# Altium schematic sheet AFE_ADC.SchDoc: Shuttler AFE
size A4; Author: G.Kasprowicz; CompanyName: WUT ISE; DrawnBy: G.Kasprowicz; Organization: WUT ISE; Address1: PW ISE; Address2: Nowowiejska 15/19 00-665 Warsaw; Address3: gkasprow@gmail.com; DocumentNumber: 2; SheetNumber: 2; SheetTotal: 6; ModifiedBy: -; CheckedDate: -; Title2: ADC; DivGrp: WUT ISE; Designer: G.Kasprowicz; ModifiedDate: -; ProjectName: Sensor Box
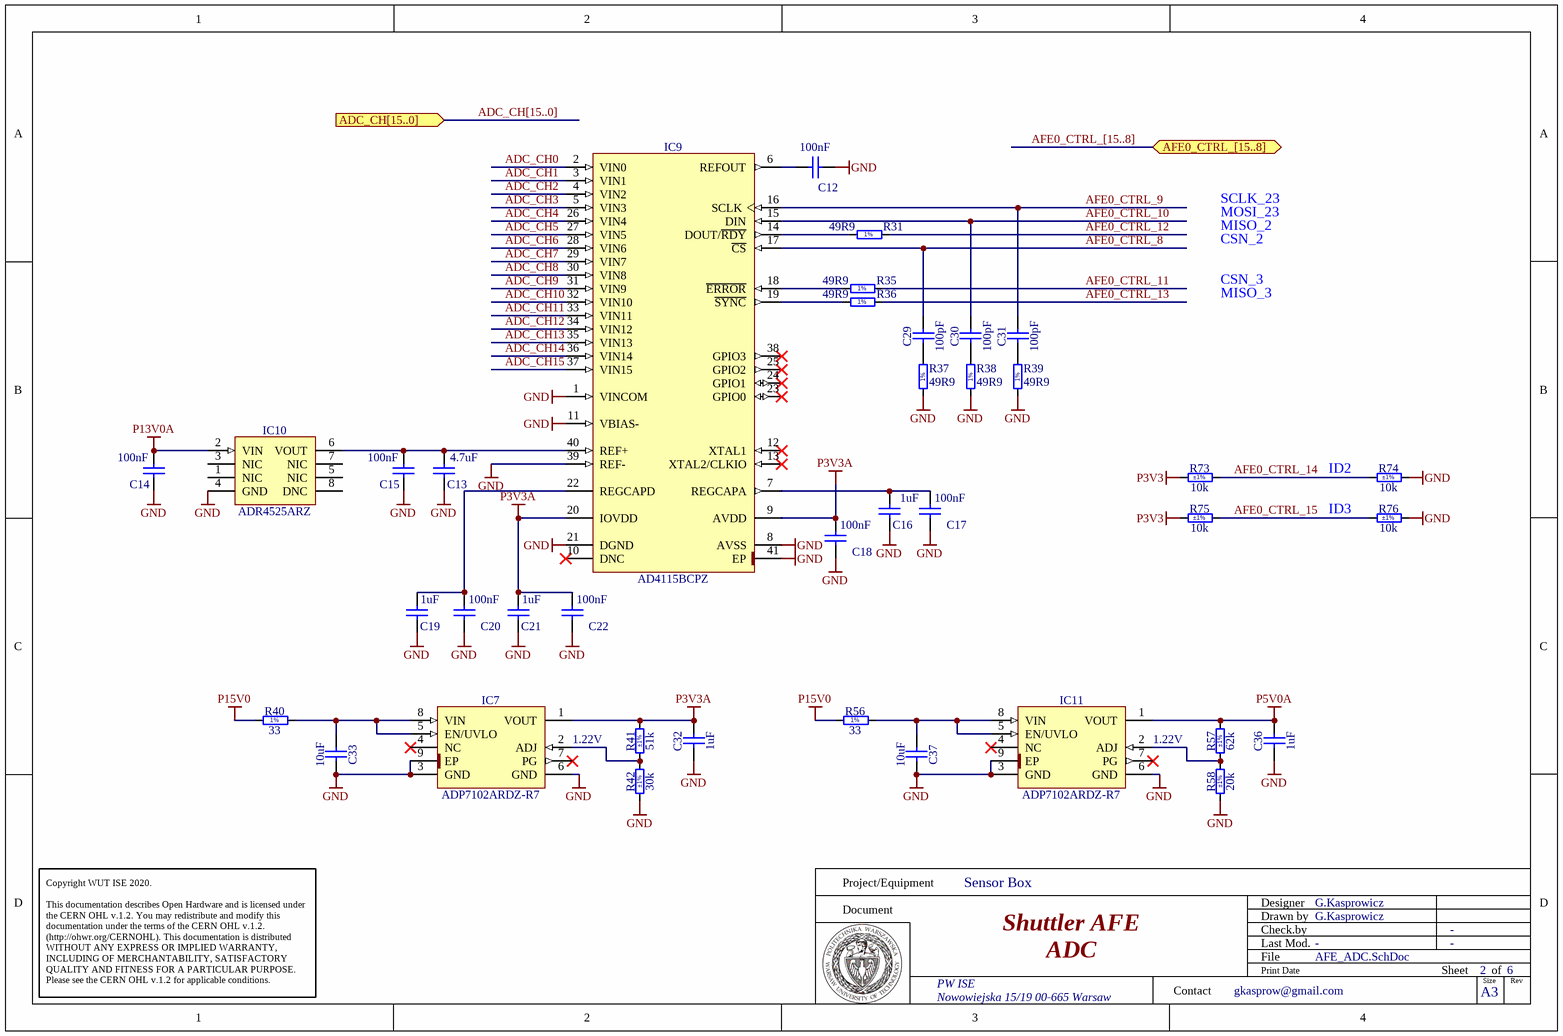
[diagram p0: AFE_ADC.SchDoc]

## Parts
C12  100nF  [CAPC1005X55N]
C13  4.7uF  [CAPC1608X90N]
C14  100nF  [CAPC1005X55N]
C15  100nF  [CAPC1005X55N]
C16  1uF  [CAPC1608X87N]
C17  100nF  [CAPC1005X55N]
C18  100nF  [CAPC1005X55N]
C19  1uF  [CAPC1608X87N]
C20  100nF  [CAPC1005X55N]
C21  1uF  [CAPC1608X87N]
C22  100nF  [CAPC1005X55N]
C29  100pF  [CAPC1005X55N]
C30  100pF  [CAPC1005X55N]
C31  100pF  [CAPC1005X55N]
C32  1uF  [CAPC1608X87N]
C33  10uF  [CAPC2012X135N]
C36  1uF  [CAPC1608X87N]
C37  10uF  [CAPC2012X135N]
IC7  ADP7102ARDZ-R7  [SOIC127P600X175-9N-R241X309]
IC9  AD4115BCPZ  [QFN50P600X600X100-41N-S470]
IC10  ADR4525ARZ  [SOIC127P600X175-8N]
IC11  ADP7102ARDZ-R7  [SOIC127P600X175-9N-R241X309]
R31  49R9  [RESC1005X40N]
R35  49R9  [RESC1005X40N]
R36  49R9  [RESC1005X40N]
R37  49R9  [RESC1005X40N]
R38  49R9  [RESC1005X40N]
R39  49R9  [RESC1005X40N]
R40  33  [RESC1005X40N]
R41  51k  Tolerance: ±1%  [RESC1005X40N]
R42  30k  Tolerance: ±1%  [RESC1005X40N]
R56  33  [RESC1005X40N]
R57  62k  Tolerance: ±1%  [RESC1005X40N]
R58  20k  Tolerance: ±1%  [RESC1005X40N]
R73  10k  Tolerance: ±1%  [RESC1005X40N]
R74  10k  Tolerance: ±1%  [RESC1005X40N]
R75  10k  Tolerance: ±1%  [RESC1005X40N]
R76  10k  Tolerance: ±1%  [RESC1005X40N]

## Ports
ADC_CH[15..0] (in), AFE0_CTRL_[15..8] (bidir)

## Nets
GND: C12.2 C13.1 C14.2 C15.2 C16.1 C17.2 C18.2 C19.1 C20.2 C21.1 C22.2 C32.1 C33.2 C36.1 C37.2 IC7.3(GND) IC7.6(GND) IC7.9(EP) IC9.1(VINCOM) IC9.8(AVSS) IC9.11(VBIAS-) IC9.21(DGND) IC9.39(REF-) IC9.41(EP) IC10.4(GND) IC11.3(GND) IC11.6(GND) IC11.9(EP) R37.1 R38.1 R39.1 R42.1 R58.1 R74.2 R76.2
P3V3: R73.1 R75.1
P3V3A: C18.1 C21.2 C22.1 C32.2 IC7.1(VOUT) IC9.9(AVDD) IC9.20(IOVDD) R41.2
P5V0A: C36.2 IC11.1(VOUT) R57.2
P13V0A: C14.1 IC10.2(VIN)
P15V0: R40.1 R56.1
ADC_CH0: IC9.2(VIN0)
ADC_CH1: IC9.3(VIN1)
ADC_CH2: IC9.4(VIN2)
ADC_CH3: IC9.5(VIN3)
ADC_CH4: IC9.26(VIN4)
ADC_CH5: IC9.27(VIN5)
ADC_CH6: IC9.28(VIN6)
ADC_CH7: IC9.29(VIN7)
ADC_CH8: IC9.30(VIN8)
ADC_CH9: IC9.31(VIN9)
ADC_CH10: IC9.32(VIN10)
ADC_CH11: IC9.33(VIN11)
ADC_CH12: IC9.34(VIN12)
ADC_CH13: IC9.35(VIN13)
ADC_CH14: IC9.36(VIN14)
ADC_CH15: IC9.37(VIN15)
AFE0_CTRL_8: C29.2 IC9.17(~{CS})
AFE0_CTRL_9: C31.2 IC9.16(SCLK)
AFE0_CTRL_10: C30.2 IC9.15(DIN)
AFE0_CTRL_11: R35.2
AFE0_CTRL_12: R31.2
AFE0_CTRL_13: R36.2
AFE0_CTRL_14: R73.2 R74.1
AFE0_CTRL_15: R75.2 R76.1
NetC12_1: C12.1 IC9.6(REFOUT)
NetC13_2: C13.2 C15.1 IC9.40(REF+) IC10.6(VOUT)
NetC16_2: C16.2 C17.1 IC9.7(REGCAPA)
NetC19_2: C19.2 C20.1 IC9.22(REGCAPD)
NetC29_1: C29.1 R37.2
NetC30_1: C30.1 R38.2
NetC31_1: C31.1 R39.2
NetC33_1: C33.1 IC7.5(EN/UVLO) IC7.8(VIN) R40.2
NetC37_1: C37.1 IC11.5(EN/UVLO) IC11.8(VIN) R56.2
NetIC7_2: IC7.2(ADJ) R41.1 R42.2
NetIC9_14: IC9.14(DOUT/~{RDY}) R31.1
NetIC9_18: IC9.18(~{ERROR}) R35.1
NetIC9_19: IC9.19(~{SYNC}) R36.1
NetIC11_2: IC11.2(ADJ) R57.1 R58.2

Not connected (* = marked no-connect by the designer): IC7 4(NC)* 7(PG)*; IC9 10(DNC)* 12(XTAL1)* 13(XTAL2/CLKIO)* 23(GPIO0)* 24(GPIO1)* 25(GPIO2)* 38(GPIO3)*; IC10 1(NIC) 3(NIC) 5(NIC) 7(NIC) 8(DNC); IC11 4(NC)* 7(PG)*

## Buses and harness runs
bus ADC_CH[15..0] = port ADC_CH[15..0]
bus AFE0_CTRL_[15..8] = port AFE0_CTRL_[15..8]

## Notes on the sheet
- MOSI_23
- MISO_2
- CSN_2
- SCLK_23
- CSN_3
- MISO_3
- (near R74) ID2
- ID3
- 1.22V
- Project/Equipment
- Document
- Designer
- Drawn by
- Check.by
- Copyright WUT ISE 2020.
  This documentation describes Open Hardware and is licensed under the CERN OHL v.1.2. You may redistribute and modify this documentation under the terms of the CERN OHL v.1.2. (http://ohwr.org/CERNOHL). This documentation is distributed WITHOUT ANY EXPRESS OR IMPLIED WARRANTY, INCLUDING OF MERCHANTABILITY, SATISFACTORY QUALITY AND FITNESS FOR A PARTICULAR PURPOSE. Please see the CERN OHL v.1.2 for applicable conditions.
- Contact
- File
- Last Mod.
- Print Date
- Sheet
- Size
- A3
- of
- Rev
- (in symbol R0402_33R_1%_0.0625W_100PPM) 1%
- (in symbol R0402_49R9_1%_0.0625W_100PPM) 1%

## Library data of the parts
C12 C14 C15 C17 C18 C20 C22 = CC0402_100NF_16V_10%_X5R: Non-polarised capacitor; Part Description: SMD Multilayer Chip Ceramic Capacitor; Manufacturer: GENERIC; Manufacturer1 Part Number: GRM155R61C104KA88D; Voltage: 16V; TC: X5R; Tolerance: ±10%; Part Number: CC0402_100NF_16V_10%_X5R; Component Kind: Standard; Component Type: Standard; Pin Count: 2; Value: 100nF; Status: None; Manufacturer Part Number: CC0402_100NF_16V_10%_X5R; Case: 0402; Mounted: Yes; Socket: No; SMD: Yes; Sense: No; Manufacturer1 Example: MURATA; Manufacturer1 ComponentHeight: 0.55mm; HelpURL: \\cern.ch\dfs\Applications\Altium\Datasheets\CC0402_X5R_MURATA_GRM.pdf; Author: CERN DEM JLC; CreateDate: 10.12.2013; LatestRevisionDate: 10.12.2013
C13 = CC0603_4.7UF_25V_10%_X5R: Non-polarised capacitor; Part Description: SMD Multilayer Chip Ceramic Capacitor; Manufacturer: GENERIC; Manufacturer1 Part Number: GRM188R61E475KE11D; Voltage: 25V; TC: X5R; Tolerance: ±10%; Part Number: CC0603_4.7UF_25V_10%_X5R; Component Kind: Standard; Component Type: Standard; Pin Count: 2; Value: 4.7uF; Status: None; Manufacturer Part Number: CC0603_4.7UF_25V_10%_X5R; Case: 0603; Mounted: Yes; Socket: No; SMD: Yes; Sense: No; Manufacturer1 Example: MURATA; Manufacturer1 ComponentHeight: 0.95mm; HelpURL: \\cern.ch\dfs\Applications\Altium\Datasheets\CC0603_MURATA_GRM188R61E475KE11D.pdf; Author: CERN DEM JLC; CreateDate: 10.11.2014; LatestRevisionDate: 10.11.2014
C16 C19 C21 = CC0603_1UF_16V_10%_X7R: Non-polarised capacitor; Part Description: SMD Multilayer Chip Ceramic Capacitor; Manufacturer: GENERIC; Manufacturer1 Part Number: 223878615663; Voltage: 16V; TC: X7R; Tolerance: ±10%; Part Number: CC0603_1UF_16V_10%_X7R; Component Kind: Standard; Component Type: Standard; Pin Count: 2; Value: 1uF; Status: None; Manufacturer Part Number: CC0603_1UF_16V_10%_X7R; Case: 0603; Mounted: Yes; Socket: No; SMD: Yes; Sense: No; Manufacturer1 Example: YAGEO PHYCOMP; Manufacturer1 ComponentHeight: 0.9mm; HelpURL: \\cern.ch\dfs\Applications\Altium\Datasheets\CC0603_X7R_PHYCOMP.pdf; Author: CERN DEM JLC; CreateDate: 03.12.2007; LatestRevisionDate: 17.04.2015
C29-C31 = CC0402_100PF_50V_5%_C0G: Non-polarised capacitor; Part Description: SMD Multilayer Chip Ceramic Capacitor; Manufacturer: GENERIC; Manufacturer1 Part Number: C0402C101J5GACTU; Voltage: 50V; TC: C0G/NP0; Tolerance: ±5%; Part Number: CC0402_100PF_50V_5%_C0G; Component Kind: Standard; Component Type: Standard; Pin Count: 2; Value: 100pF; Status: Preferred; Manufacturer Part Number: CC0402_100PF_50V_5%_C0G; Case: 0402; Mounted: Yes; Socket: No; SMD: Yes; Sense: No; Manufacturer1 Example: KEMET; Manufacturer1 ComponentHeight: 0.55mm; HelpURL: \\cern.ch\dfs\Applications\Altium\Datasheets\CC0402_C0G_KEMET_(Commercial Grade).pdf; Author: CERN DEM JLC; CreateDate: 03.12.2007; LatestRevisionDate: 22.04.2015
C32 C36 = CC0603_1UF_25V_10%_X7R: Non-polarised capacitor; Part Description: SMD Multilayer Chip Ceramic Capacitor; Manufacturer: GENERIC; Manufacturer1 Part Number: GRM188R71E105KA12D; Voltage: 25V; TC: X7R; Tolerance: ±10%; Part Number: CC0603_1UF_25V_10%_X7R; Component Kind: Standard; Component Type: Standard; Pin Count: 2; Value: 1uF; Status: None; Manufacturer Part Number: CC0603_1UF_25V_10%_X7R; Case: 0603; Mounted: Yes; Socket: No; SMD: Yes; Sense: No; Manufacturer1 Example: MURATA; Manufacturer1 ComponentHeight: 0.9mm; HelpURL: \\cern.ch\dfs\Applications\Altium\Datasheets\CC0603_X7R_MURATA.pdf; Author: CERN DEM JLC; CreateDate: 18/01/2011; LatestRevisionDate: 18/01/2011
C33 C37 = CC0805_10UF_16V_10%_X5R: Non-polarised capacitor; Part Description: SMD Multilayer Chip Ceramic Capacitor; Manufacturer: GENERIC; Manufacturer1 Part Number: C0805C106K4PAC; Voltage: 16V; TC: X5R; Tolerance: ±10%; Part Number: CC0805_10UF_16V_10%_X5R; Component Kind: Standard; Component Type: Standard; Pin Count: 2; Value: 10uF; Status: Preferred; Manufacturer Part Number: CC0805_10UF_16V_10%_X5R; Case: 0805; Mounted: Yes; Socket: No; SMD: Yes; Manufacturer1 Example: KEMET; Manufacturer1 ComponentHeight: 1.4mm; HelpURL: \\cern.ch\dfs\Applications\Altium\Datasheets\CC1206_X5R_KEMET.pdf; Author: CERN DEM JLC; CreateDate: 03.12.2007; LatestRevisionDate: 03.12.2007; Sense: No
IC7 IC11 = ADP7102ARDZ-R7: 1.22V to 19V, 300mA, Low Noise, CMOS LDO Adjustable Linear Regulator; Manufacturer: ANALOG DEVICES; PressFit: No; Bonding: No; Part Number: ADP7102ARDZ-R7; Component Kind: Standard; Component Type: Standard; Device: ADP7102ARDZ-R7; PackageDescription: SOIC 8, Pitch 1.27mm - Body 3.9x4.9mm, (w/thermal tab 2.41mm X 3.098mm), IPC Medium Density; Part Description: 1.22V to 19V, 300mA, Low Noise, CMOS LDO Adjustable Linear Regulator; Manufacturer Part Number: ADP7102ARDZ-R7; Pin Count: 8; Case: SOIC8; Mounted: Yes; Socket: No; SMD: Yes; Sense: No; ComponentHeight: 1.75mm; HelpURL: \\cern.ch\dfs\Applications\Altium\Datasheets\ADP7102ARDZ-R7.pdf; Author: CERN DEM JLC; CreateDate: 16.06.2014; LatestRevisionDate: 16.06.2014
IC9 = AD4115BCPZ: Single-Supply, Multichannel, 125kSPS, 24-Bit, Sigma-Delta ADC with ±10V Inputs; Manufacturer: ANALOG DEVICES; PressFit: No; Bonding: No; Part Number: AD4115BCPZ; Component Kind: Standard; Component Type: Standard; Device: AD4115BCPZ; PackageDescription: QFN, 0.50mm Pitch, Square; 40 Pin, 6.00mm L X 6.00mm W X 1.00mm H body (w/Thermal Tab 4.70 x 4.70mm), IPC Medium Density; Part Description: Single-Supply, Multichannel, 125kSPS, 24-Bit, Sigma-Delta ADC with ±10V Inputs; Manufacturer Part Number: AD4115BCPZ; Pin Count: 41; Case: QFN40; Mounted: Yes; Socket: No; SMD: Yes; Sense: No; ComponentHeight: 1.0mm; Author: CERN DEM BC; HelpURL: \\cern.ch\dfs\Applications\Altium\Datasheets\AD4115BCPZ.pdf; CreateDate: 30.10.2020; LatestRevisionDate: 30.10.2020
IC10 = ADR4525ARZ: 2.5V Output, 1mV ±0.04% Accuracy, 4ppm/°C Ultralow Noise, High Accuracy Voltage References; Manufacturer: ANALOG DEVICES; PressFit: No; Bonding: No; Part Number: ADR4525ARZ; Component Kind: Standard; Component Type: Standard; Device: ADR4525ARZ; PackageDescription: SOIC 8, Pitch 1.27mm, Body 4x5mm, IPC Medium Density; Part Description: 2.5V Output, 1mV ±0.04% Accuracy, 4ppm/°C Ultralow Noise, High Accuracy Voltage References; Manufacturer Part Number: ADR4525ARZ; Pin Count: 8; Case: SOIC8; Mounted: Yes; Socket: No; SMD: Yes; Sense: No; ComponentHeight: 1.75mm; HelpURL: \\cern.ch\dfs\Applications\Altium\Datasheets\ADR4525ARZ.pdf; Author: CERN DEM BC; CreateDate: 19.06.2020; LatestRevisionDate: 19.06.2020
R31 R35-R39 = R0402_49R9_1%_0.0625W_100PPM: Resistor - 1%; Part Description: General Purpose Thick Film Chip Resistor; Manufacturer: GENERIC; Manufacturer1 Part Number: 232270674999L or RC0402FR-0749R9L; TC: ±100ppm/°C; PressFit: No; Part Number: R0402_49R9_1%_0.0625W_100PPM; Component Kind: Standard; Component Type: Standard; Pin Count: 2; Value: 49R9; Status: Not Recommended; Power: 0.0625W; Tolerance: ±1%; Manufacturer Part Number: R0402_49R9_1%_0.0625W_100PPM; Case: 0402; Mounted: Yes; Sense: No; Socket: No; SMD: Yes; Manufacturer1 Example: YAGEO PHYCOMP; Manufacturer1 ComponentHeight: 0.4mm; HelpURL: \\cern.ch\dfs\Applications\Altium\Datasheets\R0402_Phycomp_RC0402.pdf; Author: CERN DEM JLC; CreateDate: 24.10.2012; LatestRevisionDate: 24.10.2012
R40 R56 = R0402_33R_1%_0.0625W_100PPM: Resistor - 1%; Part Description: General Purpose Thick Film Chip Resistor; Manufacturer: GENERIC; Manufacturer1 Part Number: 232270673309L; TC: ±100ppm/°C; PressFit: No; Part Number: R0402_33R_1%_0.0625W_100PPM; Component Kind: Standard; Component Type: Standard; Pin Count: 2; Value: 33; Status: Not Recommended; Power: 0.0625W; Tolerance: ±1%; Manufacturer Part Number: R0402_33R_1%_0.0625W_100PPM; Case: 0402; Mounted: Yes; Sense: No; Socket: No; SMD: Yes; Manufacturer1 Example: YAGEO PHYCOMP; Manufacturer1 ComponentHeight: 0.4mm; HelpURL: \\cern.ch\dfs\Applications\Altium\Datasheets\R0402_Phycomp_RC0402.pdf; Author: CERN DEM JLC; CreateDate: 03/12/2007; LatestRevisionDate: 17/10/2012
R41 = R0402_51K_1%_0.0625W_100PPM: Resistor - 1%; Part Description: General Purpose Thick Film Chip Resistor; Manufacturer: GENERIC; Manufacturer1 Part Number: 232270674703L; TC: ±100ppm/°C; PressFit: No; Part Number: R0402_51K_1%_0.0625W_100PPM; Component Kind: Standard; Component Type: Standard; Pin Count: 2; Value: 51k; Status: Not Recommended; Power: 0.0625W; Manufacturer Part Number: R0402_51K_1%_0.0625W_100PPM; Case: 0402; Mounted: Yes; Sense: No; Socket: No; SMD: Yes; Manufacturer1 Example: YAGEO PHYCOMP; Manufacturer1 ComponentHeight: 0.4mm; HelpURL: \\cern.ch\dfs\Applications\Altium\Datasheets\R0402_Phycomp_RC0402.pdf; Author: CERN DEM JLC; CreateDate: 03.12.2007; LatestRevisionDate: 17.10.2012
R42 = R0402_30K_1%_0.0625W_100PPM: Resistor - 1%; Part Description: General Purpose Thick Film Chip Resistor; Manufacturer: GENERIC; Manufacturer1 Part Number: 232270673003L; TC: ±100ppm/°C; PressFit: No; Part Number: R0402_30K_1%_0.0625W_100PPM; Component Kind: Standard; Component Type: Standard; Pin Count: 2; Value: 30k; Status: Not Recommended; Power: 0.0625W; Manufacturer Part Number: R0402_30K_1%_0.0625W_100PPM; Case: 0402; Mounted: Yes; Sense: No; Socket: No; SMD: Yes; Manufacturer1 Example: YAGEO PHYCOMP; Manufacturer1 ComponentHeight: 0.4mm; HelpURL: \\cern.ch\dfs\Applications\Altium\Datasheets\R0402_Phycomp_RC0402.pdf; Author: CERN DEM JLC; CreateDate: 03.12.2007; LatestRevisionDate: 17.10.2012
R57 = R0402_62K_1%_0.0625W_100PPM: Resistor - 1%; Part Description: General Purpose Thick Film Chip Resistor; Manufacturer: GENERIC; Manufacturer1 Part Number: 232270676203L; TC: ±100ppm/°C; PressFit: No; Part Number: R0402_62K_1%_0.0625W_100PPM; Component Kind: Standard; Component Type: Standard; Pin Count: 2; Value: 62k; Status: Not Recommended; Power: 0.0625W; Manufacturer Part Number: R0402_62K_1%_0.0625W_100PPM; Case: 0402; Mounted: Yes; Sense: No; Socket: No; SMD: Yes; Manufacturer1 Example: YAGEO PHYCOMP; Manufacturer1 ComponentHeight: 0.4mm; HelpURL: \\cern.ch\dfs\Applications\Altium\Datasheets\R0402_Phycomp_RC0402.pdf; Author: CERN DEM JLC; CreateDate: 03.12.2007; LatestRevisionDate: 17.10.2012
R58 = R0402_20K_1%_0.0625W_100PPM: Resistor - 1%; Part Description: General Purpose Thick Film Chip Resistor; Manufacturer: GENERIC; Manufacturer1 Part Number: 232270672003L; TC: ±100ppm/°C; PressFit: No; Part Number: R0402_20K_1%_0.0625W_100PPM; Component Kind: Standard; Component Type: Standard; Pin Count: 2; Value: 20k; Status: Not Recommended; Power: 0.0625W; Manufacturer Part Number: R0402_20K_1%_0.0625W_100PPM; Case: 0402; Mounted: Yes; Sense: No; Socket: No; SMD: Yes; Manufacturer1 Example: YAGEO PHYCOMP; Manufacturer1 ComponentHeight: 0.4mm; HelpURL: \\cern.ch\dfs\Applications\Altium\Datasheets\R0402_Phycomp_RC0402.pdf; Author: CERN DEM JLC; CreateDate: 03.12.2007; LatestRevisionDate: 17.10.2012
R73-R76 = R0402_10K_1%_0.0625W_100PPM: Resistor - 1%; Part Description: General Purpose Thick Film Chip Resistor; Manufacturer: GENERIC; Manufacturer1 Part Number: 232270671003L; TC: ±100ppm/°C; PressFit: No; Part Number: R0402_10K_1%_0.0625W_100PPM; Component Kind: Standard; Component Type: Standard; Pin Count: 2; Value: 10k; Status: Not Recommended; Power: 0.0625W; Manufacturer Part Number: R0402_10K_1%_0.0625W_100PPM; Case: 0402; Mounted: Yes; Sense: No; Socket: No; SMD: Yes; Manufacturer1 Example: YAGEO PHYCOMP; Manufacturer1 ComponentHeight: 0.4mm; HelpURL: \\cern.ch\dfs\Applications\Altium\Datasheets\R0402_Phycomp_RC0402.pdf; Author: CERN DEM JLC; CreateDate: 03.12.2007; LatestRevisionDate: 17.10.2012